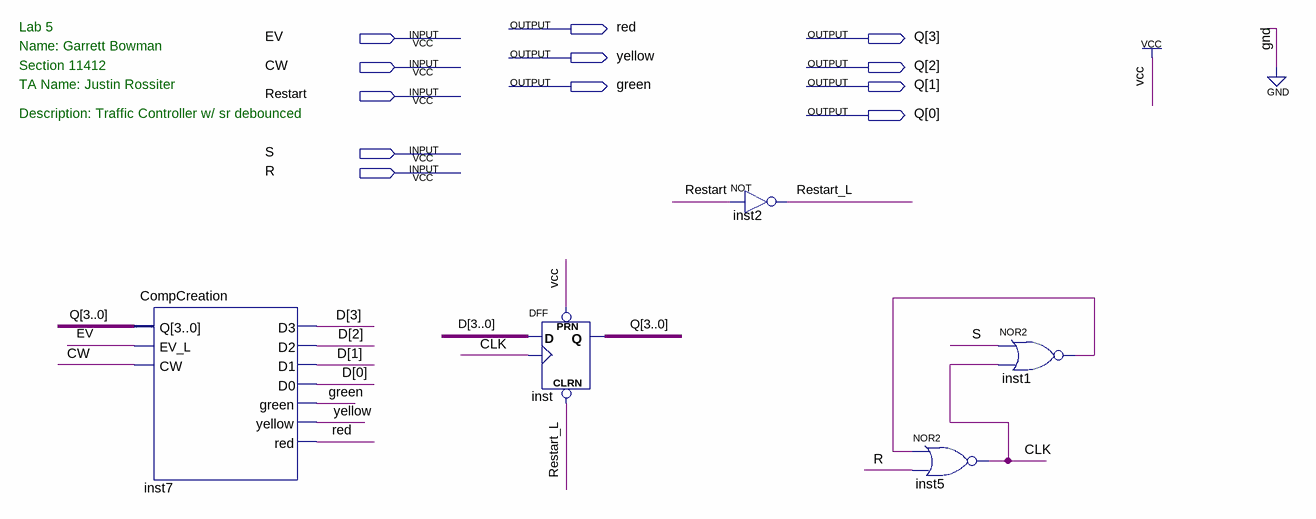
[diagram p0: schematic sheet]
// Quartus schematic Lab5_DFF_Traf_Cont.bdf as structural Verilog: 5 symbols, 12 pins
module Lab5_DFF_Traf_Cont (
  input  EV,
  input  CW,
  input  Restart,
  input  S,
  input  R,
  output red,
  output [3:0] Q,
  output yellow,
  output green
);

  wire CLK, inst1_out, Restart_L;
  wire [3:0] D;

  CompCreation inst7 (
    .Q(Q), .EV_L(EV), .CW(CW), .D3(D[3]), .D2(D[2]), .D1(D[1]), .D0(D[0]), .green(green), .yellow(yellow),
    .red(red));
  DFF inst[3:0] (.CLRN(Restart_L), .CLK(CLK), .D(D), .PRN(1'b1), .Q(Q));
  not inst2 (Restart_L, Restart);
  nor inst5 (CLK, inst1_out, R);
  nor inst1 (inst1_out, S, CLK);

  // Notes on the sheet:
  //   Lab 5 
  //   Name: Garrett Bowman
  //   Section 11412
  //   TA Name: Justin Rossiter
  //   Description: Traffic Controller w/ sr debounced
endmodule
